# EasyEDA Pro project STEP Controller.eprj, schematic Schematic1, sheet 1 of 3

## Sheets
1 DRIVER: Board Name: Board1; Create Date: 2026-05-18; Page Name: DRIVER; Project Name: STEP Controller; Schematic Name: Schematic1; Update Date: 2026-07-30; Company: EasyEDA.com; Page Size: A4; Version: V1.0
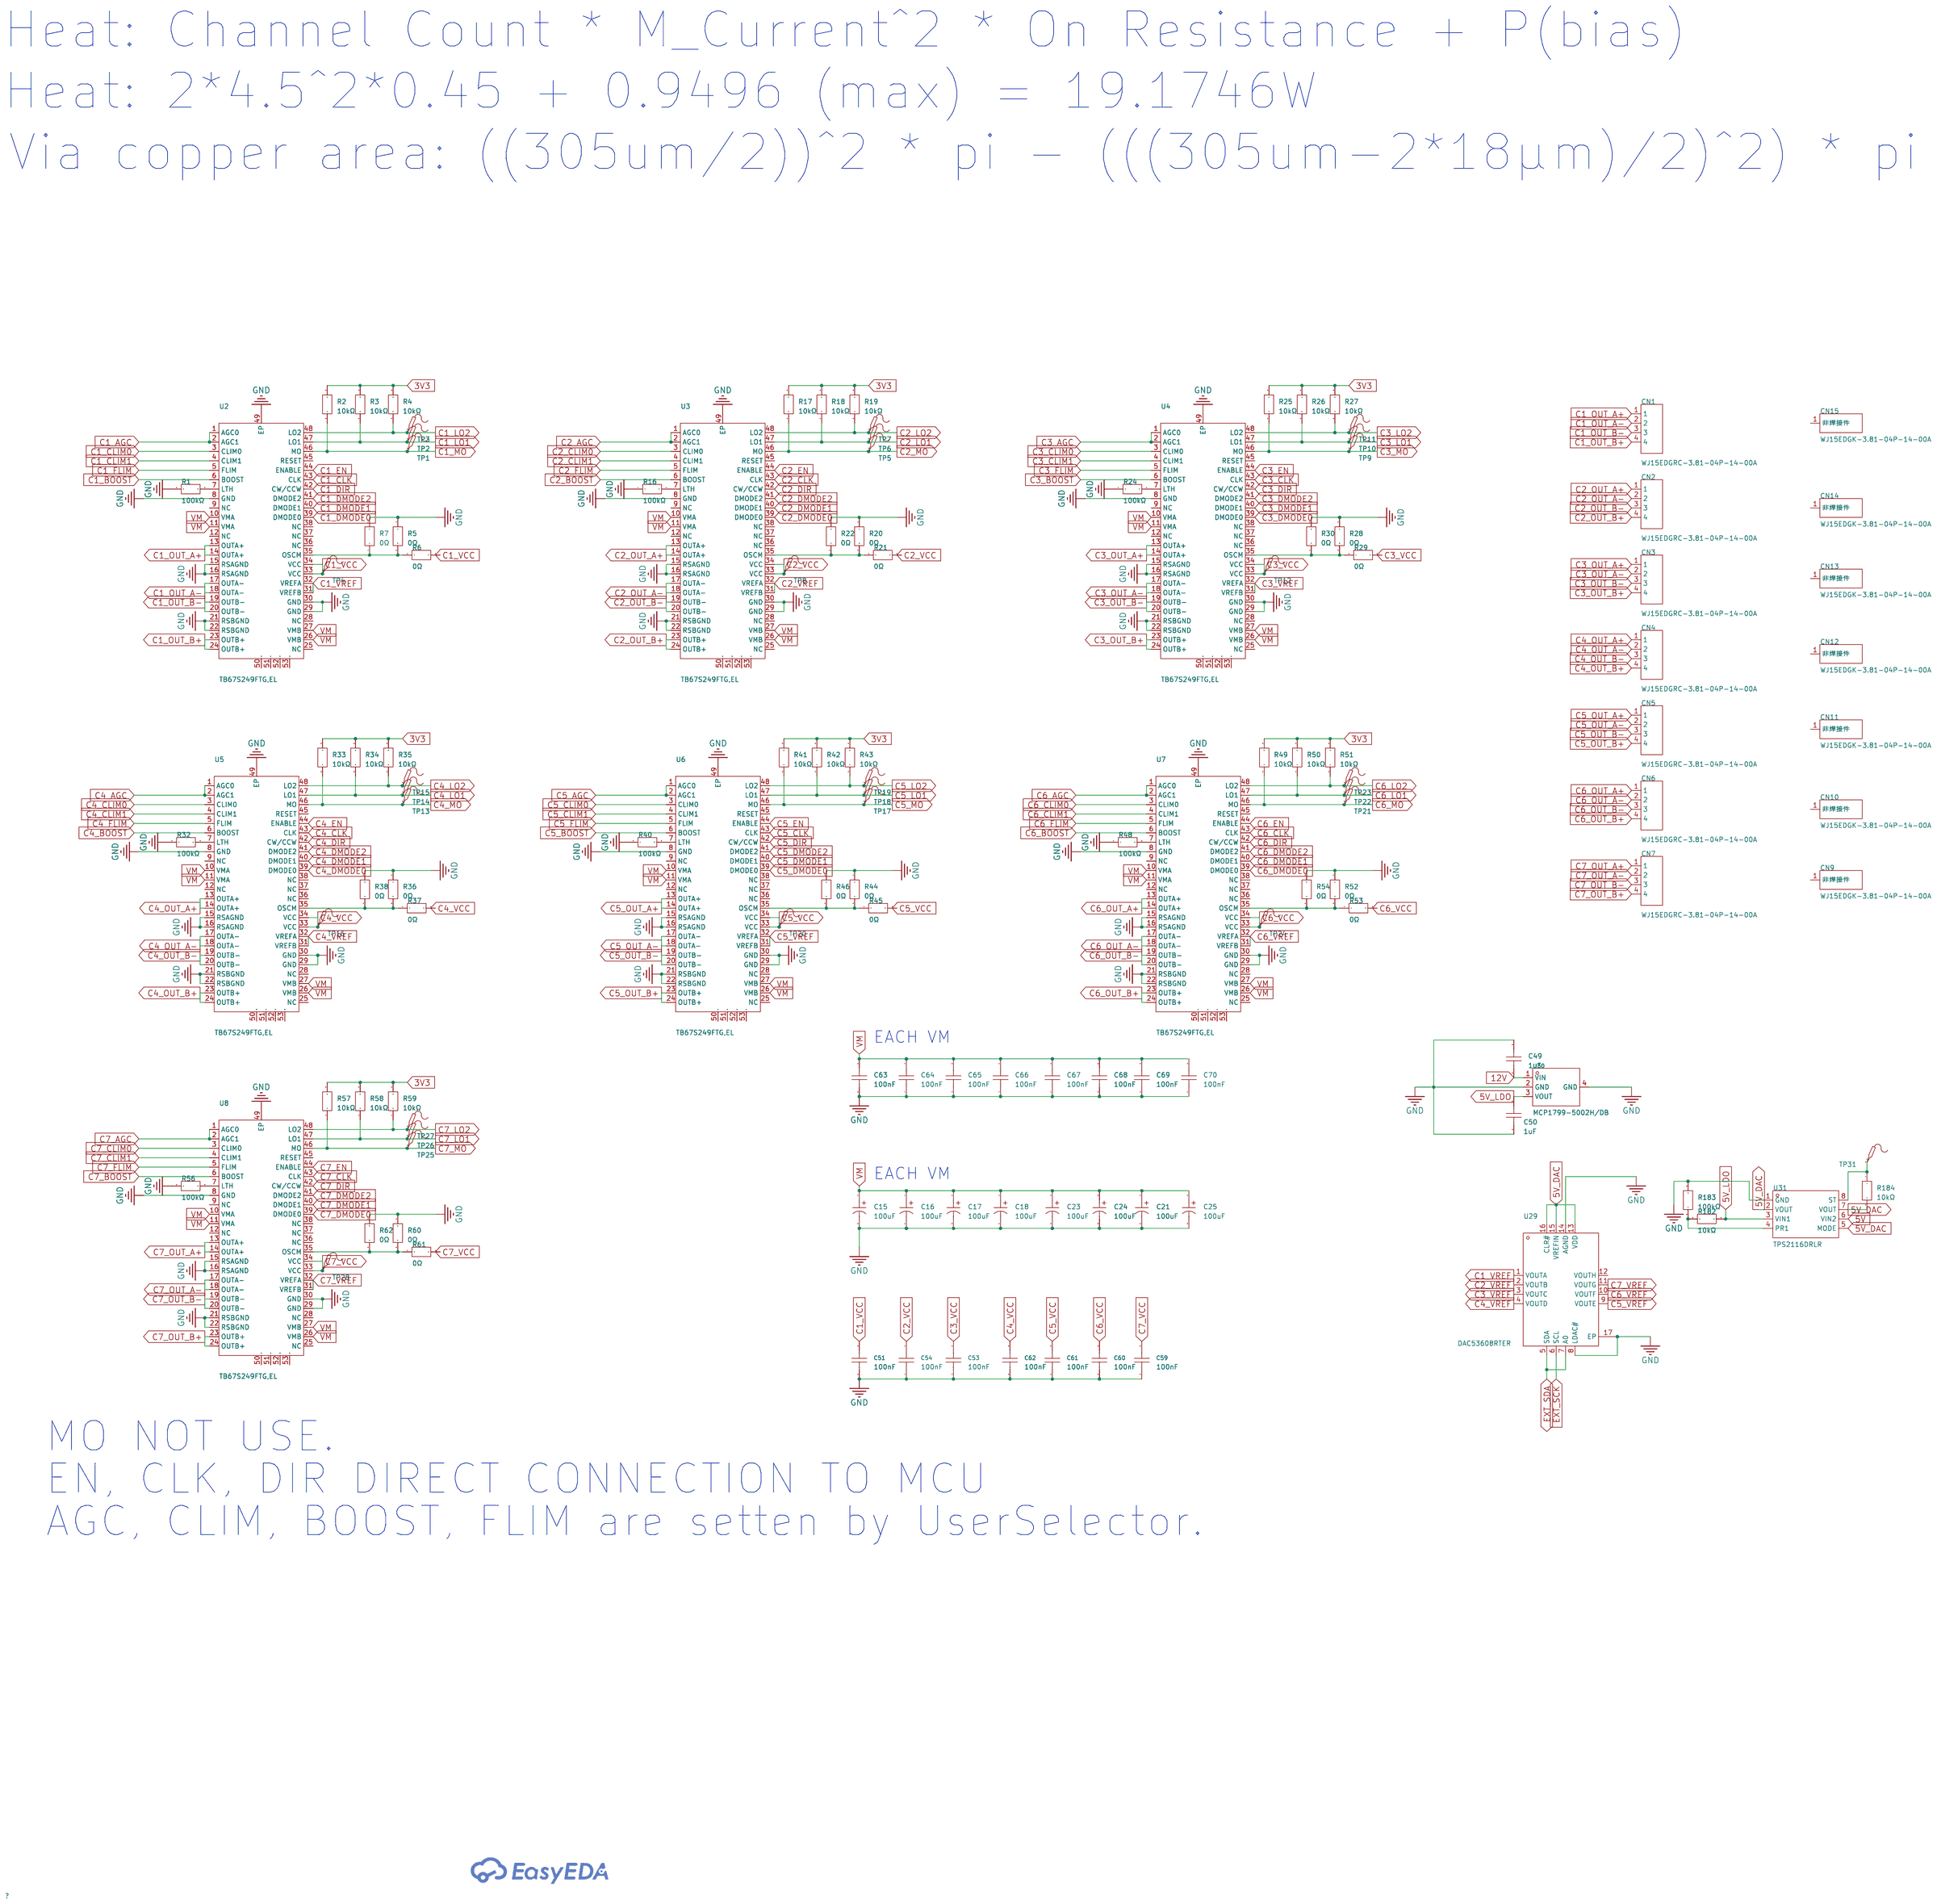
[diagram p0: DRIVER]

## Parts
C15  100uF  [CAP-TH_BD8.0-P3.50-D0.6-FD_1]
C16  100uF  [CAP-TH_BD8.0-P3.50-D0.6-FD_1]
C17  100uF  [CAP-TH_BD8.0-P3.50-D0.6-FD_1]
C18  100uF  [CAP-TH_BD8.0-P3.50-D0.6-FD_1]
C21  100uF  [CAP-TH_BD8.0-P3.50-D0.6-FD_1]
C23  100uF  [CAP-TH_BD8.0-P3.50-D0.6-FD_1]
C24  100uF  [CAP-TH_BD8.0-P3.50-D0.6-FD_1]
C25  100uF  [CAP-TH_BD8.0-P3.50-D0.6-FD_1]
C49  1uF  [C0603]
C50  1uF  [C0603]
C51  100nF  [C0603]
C53  100nF  [C0603]
C54  100nF  [C0603]
C59  100nF  [C0603]
C60  100nF  [C0603]
C61  100nF  [C0603]
C62  100nF  [C0603]
C63  100nF  [C0805]
C64  100nF  [C0805]
C65  100nF  [C0805]
C66  100nF  [C0805]
C67  100nF  [C0805]
C68  100nF  [C0805]
C69  100nF  [C0805]
C70  100nF  [C0805]
CN1  WJ15EDGRC-3.81-04P-14-00A  [CONN-TH_WJ15EDGRC-3.81-4P]
CN2  WJ15EDGRC-3.81-04P-14-00A  [CONN-TH_WJ15EDGRC-3.81-4P]
CN3  WJ15EDGRC-3.81-04P-14-00A  [CONN-TH_WJ15EDGRC-3.81-4P]
CN4  WJ15EDGRC-3.81-04P-14-00A  [CONN-TH_WJ15EDGRC-3.81-4P]
CN5  WJ15EDGRC-3.81-04P-14-00A  [CONN-TH_WJ15EDGRC-3.81-4P]
CN6  WJ15EDGRC-3.81-04P-14-00A  [CONN-TH_WJ15EDGRC-3.81-4P]
CN7  WJ15EDGRC-3.81-04P-14-00A  [CONN-TH_WJ15EDGRC-3.81-4P]
CN9  WJ15EDGK-3.81-04P-14-00A  [FL_001]
CN10  WJ15EDGK-3.81-04P-14-00A  [FL_001]
CN11  WJ15EDGK-3.81-04P-14-00A  [FL_001]
CN12  WJ15EDGK-3.81-04P-14-00A  [FL_001]
CN13  WJ15EDGK-3.81-04P-14-00A  [FL_001]
CN14  WJ15EDGK-3.81-04P-14-00A  [FL_001]
CN15  WJ15EDGK-3.81-04P-14-00A  [FL_001]
R1  100kΩ  [R0603]
R2  10kΩ  [R0603]
R3  10kΩ  [R0603]
R4  10kΩ  [R0603]
R5  0Ω  [R0603]
R6  0Ω  [R0603]
R7  0Ω  [R0603]
R16  100kΩ  [R0603]
R17  10kΩ  [R0603]
R18  10kΩ  [R0603]
R19  10kΩ  [R0603]
R20  0Ω  [R0603]
R21  0Ω  [R0603]
R22  0Ω  [R0603]
R24  100kΩ  [R0603]
R25  10kΩ  [R0603]
R26  10kΩ  [R0603]
R27  10kΩ  [R0603]
R28  0Ω  [R0603]
R29  0Ω  [R0603]
R30  0Ω  [R0603]
R32  100kΩ  [R0603]
R33  10kΩ  [R0603]
R34  10kΩ  [R0603]
R35  10kΩ  [R0603]
R36  0Ω  [R0603]
R37  0Ω  [R0603]
R38  0Ω  [R0603]
R40  100kΩ  [R0603]
R41  10kΩ  [R0603]
R42  10kΩ  [R0603]
R43  10kΩ  [R0603]
R44  0Ω  [R0603]
R45  0Ω  [R0603]
R46  0Ω  [R0603]
R48  100kΩ  [R0603]
R49  10kΩ  [R0603]
R50  10kΩ  [R0603]
R51  10kΩ  [R0603]
R52  0Ω  [R0603]
R53  0Ω  [R0603]
R54  0Ω  [R0603]
R56  100kΩ  [R0603]
R57  10kΩ  [R0603]
R58  10kΩ  [R0603]
R59  10kΩ  [R0603]
R60  0Ω  [R0603]
R61  0Ω  [R0603]
R62  0Ω  [R0603]
R182  10kΩ  [R0603]
R183  100kΩ  [R0603]
R184  10kΩ  [R0603]
TP1  -  [Test-Point-0.5mm]
TP2  -  [Test-Point-0.5mm]
TP3  -  [Test-Point-0.5mm]
TP4  -  [Test-Point-0.5mm]
TP5  -  [Test-Point-0.5mm]
TP6  -  [Test-Point-0.5mm]
TP7  -  [Test-Point-0.5mm]
TP8  -  [Test-Point-0.5mm]
TP9  -  [Test-Point-0.5mm]
TP10  -  [Test-Point-0.5mm]
TP11  -  [Test-Point-0.5mm]
TP12  -  [Test-Point-0.5mm]
TP13  -  [Test-Point-0.5mm]
TP14  -  [Test-Point-0.5mm]
TP15  -  [Test-Point-0.5mm]
TP16  -  [Test-Point-0.5mm]
TP17  -  [Test-Point-0.5mm]
TP18  -  [Test-Point-0.5mm]
TP19  -  [Test-Point-0.5mm]
TP20  -  [Test-Point-0.5mm]
TP21  -  [Test-Point-0.5mm]
TP22  -  [Test-Point-0.5mm]
TP23  -  [Test-Point-0.5mm]
TP24  -  [Test-Point-0.5mm]
TP25  -  [Test-Point-0.5mm]
TP26  -  [Test-Point-0.5mm]
TP27  -  [Test-Point-0.5mm]
TP28  -  [Test-Point-0.5mm]
TP31  -  [Test-Point-0.5mm]
U2  TB67S249FTG,EL  [P-VQFN-48_L7.0-W7.0-P0.50-BL-EP5.5]
U3  TB67S249FTG,EL  [P-VQFN-48_L7.0-W7.0-P0.50-BL-EP5.5]
U4  TB67S249FTG,EL  [P-VQFN-48_L7.0-W7.0-P0.50-BL-EP5.5]
U5  TB67S249FTG,EL  [P-VQFN-48_L7.0-W7.0-P0.50-BL-EP5.5]
U6  TB67S249FTG,EL  [P-VQFN-48_L7.0-W7.0-P0.50-BL-EP5.5]
U7  TB67S249FTG,EL  [P-VQFN-48_L7.0-W7.0-P0.50-BL-EP5.5]
U8  TB67S249FTG,EL  [P-VQFN-48_L7.0-W7.0-P0.50-BL-EP5.5]
U29  DAC53608RTER  [WQFN-16_L3.0-W3.0-P0.50-BL-EP1.7]
U30  MCP1799-5002H/DB  [SOT-223-3_L6.7-W3.7-P2.30-LS7.0-BR]
U31  TPS2116DRLR  [SOT-583-8_L2.1-W1.6-P0.50-LS1.6-BL]

## Library data of the parts
C15-C18 C21 C23-C25 = ERS1JM101F12OTG: Capacitance:100uF Tolerance:±20% Tolerance:±20% Voltage Rating:63V Pin Spacing:3.5mm Diameter:8mm Height - Seated (Max):12mm Operating Temperature:-40℃~+105℃ Operating Temperature:-40℃~+105℃; LCSC Part Name: 100uF ±20% 63V; Supplier Part: C2990945; Manufacturer: AISHI(艾华集团); Supplier Footprint: 插件,D8xL12mm; JLCPCB Part Class: Extended Part; Datasheet: https://item.szlcsc.com/datasheet/ERS1JM101F12OTG/3452241.html; Supplier: LCSC; Tolerance: ±20%; Voltage Rating: 63V; Pin Spacing: 3.5mm; Diameter: 8mm; Height - Seated (Max): 12mm; Operating Temperature: -40℃~+105℃
C49 C50 = CL10A105KB8NNNC: LCSC Part Name: 1uF ±10% 50V; Supplier Part: C15849; Manufacturer: SAMSUNG(三星); Supplier Footprint: 0603; JLCPCB Part Class: Basic Part; Datasheet: https://item.szlcsc.com/datasheet/CL10A105KB8NNNC/16531.html; Supplier: LCSC; Tolerance: ±10%; Voltage Rating: 50V; Temperature Coefficient: X5R
C51 C53 C54 C59-C62 = CC0603KRX7R9BB104: Capacitance:100nF Tolerance:±10% Tolerance:±10% Voltage Rating:50V Temperature Coefficient:X7R; LCSC Part Name: 100nF ±10% 50V; Supplier Part: C14663; Manufacturer: YAGEO(国巨); Supplier Footprint: 0603; JLCPCB Part Class: Basic Part; Datasheet: https://item.szlcsc.com/datasheet/CC0603KRX7R9BB104/15331.html; Supplier: LCSC; Tolerance: ±10%; Voltage Rating: 50V; Temperature Coefficient: X7R
C63-C70 = C0805C104KMRECAUTO: LCSC Part Name: 100nF ±10% 63V; Supplier Part: C2216234; Manufacturer: KEMET(基美); Supplier Footprint: 0805; JLCPCB Part Class: Extended Part; Datasheet: https://item.szlcsc.com/datasheet/C0805C104KMRECAUTO/2308308.html; Supplier: LCSC; Tolerance: ±10%; Voltage Rating: 63V; Temperature Coefficient: X7R
CN1-CN7 = WJ15EDGRC-3.81-04P-14-00A: LCSC Part Name: 卡扣固定 1x4P 3.81mm 排数:1 每排P数:4; Supplier Part: C7245; Manufacturer: KANGNEX(康奈克斯电气); Supplier Footprint: 弯插,P=3.81mm; JLCPCB Part Class: Extended Part; Datasheet: https://item.szlcsc.com/datasheet/WJ15EDGRC-3.81-04P-14-00A/7720.html; Supplier: LCSC; Connector Type: Board Side/Socket - Closed; Termination Style: Hinged (Snap On); Number of Positions or Pins: 1x4P; Pitch: 3.81mm; Color: Green; Mounting Type: Right-Angle; Number of Pins: 4P; Number of Rows: 1; Number of PINs Per Row: 4; Current Rating: 8A; Voltage Rating (Max): 300V; Operating Temperature: -40℃~+105℃
CN9-CN15 = WJ15EDGK-3.81-04P-14-00A: LCSC Part Name: 1x4P 3.81mm 排数:1 每排P数:4; Supplier Part: C7244; Manufacturer: KANGNEX(康奈克斯电气); Supplier Footprint: P=3.81mm; JLCPCB Part Class: Extended Part; Datasheet: https://item.szlcsc.com/datasheet/WJ15EDGK-3.81-04P-14-00A/7719.html; Supplier: LCSC; Connector Type: Male Plug; Number of Positions or Pins: 1x4P; Pitch: 3.81mm; Number of Pins: 4P; Number of Rows: 1; Number of PINs Per Row: 4; Current Rating: 8A; Voltage Rating (Max): 300V; Wire Gauge - AWG: 16~28; Wire Gauge - mm2: 1.5; Operating Temperature: -40℃~+105℃; Connection Type: Screw Connection (M2); Outlet Direction (Vertical Basis): Top Entry
R1 R16 R24 R32 R40 R48 R56 R183 = 0603WAF1003T5E: Type:Thick Film Resistor Resistance:100kΩ Tolerance:±1% Tolerance:±1% Power(Watts):100mW Voltage-Supply(Max):75V Temperature Coefficient:±100ppm/℃ Temperature Coefficient:±100ppm/℃ Operating Temperature:-55℃~+155℃ Operating Temperature:-55℃~+155℃; LCSC Part Name: 100kΩ ±1% 100mW 厚膜电阻; Supplier Part: C25803; Manufacturer: UNI-ROYAL(厚声); Supplier Footprint: 0603; JLCPCB Part Class: Basic Part; Datasheet: https://item.szlcsc.com/datasheet/0603WAF1003T5E/26546.html; Supplier: LCSC; Type: Thick Film Resistor; Tolerance: ±1%; Power(Watts): 100mW; Voltage-Supply(Max): 75V; Temperature Coefficient: ±100ppm/℃; Operating Temperature: -55℃~+155℃
R2-R4 R17-R19 R25-R27 R33-R35 R41-R43 R49-R51 R57-R59 R182 R184 = 0603WAF1002T5E: Type:Thick Film Resistor Resistance:10kΩ Tolerance:±1% Tolerance:±1% Power(Watts):100mW Voltage-Supply(Max):75V Temperature Coefficient:±100ppm/℃ Temperature Coefficient:±100ppm/℃ Operating Temperature:-55℃~+155℃ Operating Temperature:-55℃~+155℃; LCSC Part Name: 厚膜电阻 10kΩ ±1% 100mW; Supplier Part: C25804; Manufacturer: UNI-ROYAL(厚声); Supplier Footprint: 0603; JLCPCB Part Class: Basic Part; Datasheet: https://item.szlcsc.com/datasheet/0603WAF1002T5E/26547.html; Supplier: LCSC; Type: Thick Film Resistor; Tolerance: ±1%; Power(Watts): 100mW; Voltage-Supply(Max): 75V; Temperature Coefficient: ±100ppm/℃; Operating Temperature: -55℃~+155℃
R5-R7 R20-R22 R28-R30 R36-R38 R44-R46 R52-R54 R60-R62 = 0603WAF0000T5E: Type:Thick Film Resistor Resistance:0Ω Tolerance:±1% Tolerance:±1% Power(Watts):100mW Voltage-Supply(Max):75V Temperature Coefficient:- Temperature Coefficient:- Operating Temperature:-55℃~+155℃ Operating Temperature:-55℃~+155℃; LCSC Part Name: 0Ω ±1% 100mW 厚膜电阻; Supplier Part: C21189; Manufacturer: UNI-ROYAL(厚声); Supplier Footprint: 0603; JLCPCB Part Class: Basic Part; Datasheet: https://item.szlcsc.com/datasheet/0603WAF0000T5E/21903.html; Supplier: LCSC; Type: Thick Film Resistor; Tolerance: ±1%; Power(Watts): 100mW; Voltage-Supply(Max): 75V; Operating Temperature: -55℃~+155℃
TP1-TP28 TP31 = Test-Point
U2-U8 = TB67S249FTG,EL: LCSC Part Name: 4.5A 5.25V电机驱动芯片; Supplier Part: C2150608; Manufacturer: TOSHIBA(东芝); Supplier Footprint: QFN-48-EP(7x7); JLCPCB Part Class: Extended Part; Datasheet: https://item.szlcsc.com/datasheet/TB67S249FTG%252CEL/2242655.html; Supplier: LCSC; Control Voltage: 4.75V~5.25V; Motor Drive Voltage(Vm): 10V~47V; Output Current: 4.5A; Number of H-bridges: 2; Drive Type: Bipolar Driver; Step Resolution: 8；2；1；16；4；32; Interface: STEP/DIR; Technology: Yes; RDS(on): 330mΩ; Operating Temperature: -20℃~+85℃
U29 = DAC53608RTER: LCSC Part Name: 采用微型3×3 WQFN封装的八路10位或8位I²C接口缓冲电压输出DAC; Supplier Part: C2679625; Manufacturer: TI(德州仪器); Supplier Footprint: WQFN-16-EP(3x3); JLCPCB Part Class: Extended Part; Datasheet: https://www.ti.com/cn/lit/gpn/dac53608; Supplier: LCSC; Resolution(Bits): 10; Number of Channels: 8; Interface: I2C; Voltage - Supply: 1.8V~5.5V; Settling Time: 10us; Output Type: Voltage Buffer; Integral non - linearity: 1LSB; Operating Temperature: -40℃~+125℃; Power-On Reset: Built-in; Voltage Reference: External; Data rate: 1MHz；100kHz；400kHz; Quiescent Current (Iq): 3mA
U30 = MCP1799-5002H/DB: LCSC Part Name: 输入45V 输出5V 80mA; Supplier Part: C3746279; Manufacturer: MICROCHIP(美国微芯); Supplier Footprint: SOT-223-3; JLCPCB Part Class: Extended Part; Datasheet: https://item.szlcsc.com/datasheet/MCP1799-5002H%252FDB/4313806.html; Supplier: LCSC; Output Type: Fixed; Voltage - Supply: 45V; Output Voltage: 5V; Output Current: 80mA; Power Supply Rejection Ratio (PSRR): 70dB@(1kHz); Voltage Dropout: 300mV@(80mA); standby current: 25uA; Noise: 500uVrms; Features: Short Circuit Protection；Thermal Shutdown; Operating Temperature: -40℃~+150℃@(Ta); Output Configuration: Positive; Number of Outputs: 1
U31 = TPS2116DRLR: LCSC Part Name: 具有手动和优先级切换功能的1.6V至5.5V、2.5A低IQ电源多路复用器; Supplier Part: C3235557; Manufacturer: TI(德州仪器); Supplier Footprint: SOT-583; JLCPCB Part Class: Extended Part; Datasheet: https://www.ti.com/cn/lit/gpn/tps2116; Supplier: LCSC; Features: Operation status indication

## Nets
3V3: R2.2 R3.2 R4.2 R17.2 R18.2 R19.2 R25.2 R26.2 R27.2 R33.2 R34.2 R35.2 R41.2 R42.2 R43.2 R49.2 R50.2 R51.2 R57.2 R58.2 R59.2 ; also on sheet 2
5V: U31.6(VIN2) ; also on sheet 2
5V_DAC: R184.2 U29.13(VDD) U29.15(VREFIN) U29.16(CLR#) U31.2(VOUT) U31.5(MODE) U31.7(VOUT)
5V_LDO: C50.2 R182.1 U30.3(VOUT) U31.3(VIN1)
12V: C49.1 U30.1(VIN) ; also on sheet 2
GND: C15.2 C16.2 C17.2 C18.2 C21.2 C23.2 C24.2 C25.2 C49.2 C50.1 C51.1 C53.1 C54.1 C59.1 C60.1 C61.1 C62.1 C63.1 C64.1 C65.1 C66.1 C67.1 C68.1 C69.1 C70.1 R1.1 R5.1 R7.2 R16.1 R20.1 R22.2 R24.1 R28.1 R30.2 R32.1 R36.1 R38.2 R40.1 R44.1 R46.2 R48.1 R52.1 R54.2 R56.1 R60.1 R62.2 R183.2 U2.8(GND) U2.15(RSAGND) U2.16(RSAGND) U2.21(RSBGND) U2.22(RSBGND) U2.29(GND) U2.30(GND) U2.49(EP) U3.8(GND) U3.15(RSAGND) U3.16(RSAGND) U3.21(RSBGND) U3.22(RSBGND) U3.29(GND) U3.30(GND) U3.49(EP) U4.8(GND) U4.15(RSAGND) U4.16(RSAGND) U4.21(RSBGND) U4.22(RSBGND) U4.29(GND) U4.30(GND) U4.49(EP) U5.8(GND) U5.15(RSAGND) U5.16(RSAGND) U5.21(RSBGND) U5.22(RSBGND) U5.29(GND) U5.30(GND) U5.49(EP) U6.8(GND) U6.15(RSAGND) U6.16(RSAGND) U6.21(RSBGND) U6.22(RSBGND) U6.29(GND) U6.30(GND) U6.49(EP) U7.8(GND) U7.15(RSAGND) U7.16(RSAGND) U7.21(RSBGND) U7.22(RSBGND) U7.29(GND) U7.30(GND) U7.49(EP) U8.8(GND) U8.15(RSAGND) U8.16(RSAGND) U8.21(RSBGND) U8.22(RSBGND) U8.29(GND) U8.30(GND) U8.49(EP) U29.8(LDAC#) U29.14(AGND) U29.17(EP) U30.2(GND) U30.4(GND) U31.1(GND) ; also on sheet 2 3
C1_AGC: U2.1(AGC0) U2.2(AGC1) ; also on sheet 3
C1_BOOST: U2.6(BOOST) ; also on sheet 3
C1_CLIM0: U2.3(CLIM0) ; also on sheet 3
C1_CLIM1: U2.4(CLIM1) ; also on sheet 3
C1_CLK: U2.43(CLK) ; also on sheet 2
C1_DIR: U2.42(CW/CCW) ; also on sheet 2
C1_DMODE0: U2.39(DMODE0) ; also on sheet 2
C1_DMODE1: U2.40(DMODE1) ; also on sheet 2
C1_DMODE2: U2.41(DMODE2) ; also on sheet 2
C1_EN: U2.44(ENABLE) ; also on sheet 2
C1_FLIM: U2.5(FLIM) ; also on sheet 3
C1_LO1: R3.1 TP2.1 U2.47(LO1) ; also on sheet 2
C1_LO2: R4.1 TP3.1 U2.48(LO2) ; also on sheet 2
C1_MO: R2.1 TP1.1 U2.46(MO)
C1_OUT_A+: CN1.1 U2.13(OUTA+) U2.14(OUTA+)
C1_OUT_A-: CN1.2 U2.17(OUTA-) U2.18(OUTA-)
C1_OUT_B+: CN1.4 U2.23(OUTB+) U2.24(OUTB+)
C1_OUT_B-: CN1.3 U2.19(OUTB-) U2.20(OUTB-)
C1_VCC: C51.2 R6.2 TP4.1 U2.33(VCC) U2.34(VCC) ; also on sheet 3
C1_VREF: U2.31(VREFB) U2.32(VREFA) U29.1(VOUTA)
C2_AGC: U3.1(AGC0) U3.2(AGC1) ; also on sheet 3
C2_BOOST: U3.6(BOOST) ; also on sheet 3
C2_CLIM0: U3.3(CLIM0) ; also on sheet 3
C2_CLIM1: U3.4(CLIM1) ; also on sheet 3
C2_CLK: U3.43(CLK) ; also on sheet 2
C2_DIR: U3.42(CW/CCW) ; also on sheet 2
C2_DMODE0: U3.39(DMODE0) ; also on sheet 2
C2_DMODE1: U3.40(DMODE1) ; also on sheet 2
C2_DMODE2: U3.41(DMODE2) ; also on sheet 2
C2_EN: U3.44(ENABLE) ; also on sheet 2
C2_FLIM: U3.5(FLIM) ; also on sheet 3
C2_LO1: R18.1 TP6.1 U3.47(LO1) ; also on sheet 2
C2_LO2: R19.1 TP7.1 U3.48(LO2) ; also on sheet 2
C2_MO: R17.1 TP5.1 U3.46(MO)
C2_OUT_A+: CN2.1 U3.13(OUTA+) U3.14(OUTA+)
C2_OUT_A-: CN2.2 U3.17(OUTA-) U3.18(OUTA-)
C2_OUT_B+: CN2.4 U3.23(OUTB+) U3.24(OUTB+)
C2_OUT_B-: CN2.3 U3.19(OUTB-) U3.20(OUTB-)
C2_VCC: C54.2 R21.2 TP8.1 U3.33(VCC) U3.34(VCC) ; also on sheet 3
C2_VREF: U3.31(VREFB) U3.32(VREFA) U29.2(VOUTB)
C3_AGC: U4.1(AGC0) U4.2(AGC1) ; also on sheet 3
C3_BOOST: U4.6(BOOST) ; also on sheet 3
C3_CLIM0: U4.3(CLIM0) ; also on sheet 3
C3_CLIM1: U4.4(CLIM1) ; also on sheet 3
C3_CLK: U4.43(CLK) ; also on sheet 2
C3_DIR: U4.42(CW/CCW) ; also on sheet 2
C3_DMODE0: U4.39(DMODE0) ; also on sheet 2
C3_DMODE1: U4.40(DMODE1) ; also on sheet 2
C3_DMODE2: U4.41(DMODE2) ; also on sheet 2
C3_EN: U4.44(ENABLE) ; also on sheet 2
C3_FLIM: U4.5(FLIM) ; also on sheet 3
C3_LO1: R26.1 TP10.1 U4.47(LO1) ; also on sheet 2
C3_LO2: R27.1 TP11.1 U4.48(LO2) ; also on sheet 2
C3_MO: R25.1 TP9.1 U4.46(MO)
C3_OUT_A+: CN3.1 U4.13(OUTA+) U4.14(OUTA+)
C3_OUT_A-: CN3.2 U4.17(OUTA-) U4.18(OUTA-)
C3_OUT_B+: CN3.4 U4.23(OUTB+) U4.24(OUTB+)
C3_OUT_B-: CN3.3 U4.19(OUTB-) U4.20(OUTB-)
C3_VCC: C53.2 R29.2 TP12.1 U4.33(VCC) U4.34(VCC) ; also on sheet 3
C3_VREF: U4.31(VREFB) U4.32(VREFA) U29.3(VOUTC)
C4_AGC: U5.1(AGC0) U5.2(AGC1) ; also on sheet 3
C4_BOOST: U5.6(BOOST) ; also on sheet 3
C4_CLIM0: U5.3(CLIM0) ; also on sheet 3
C4_CLIM1: U5.4(CLIM1) ; also on sheet 3
C4_CLK: U5.43(CLK) ; also on sheet 2
C4_DIR: U5.42(CW/CCW) ; also on sheet 2
C4_DMODE0: U5.39(DMODE0) ; also on sheet 2
C4_DMODE1: U5.40(DMODE1) ; also on sheet 2
C4_DMODE2: U5.41(DMODE2) ; also on sheet 2
C4_EN: U5.44(ENABLE) ; also on sheet 2
C4_FLIM: U5.5(FLIM) ; also on sheet 3
C4_LO1: R34.1 TP14.1 U5.47(LO1) ; also on sheet 2
C4_LO2: R35.1 TP15.1 U5.48(LO2) ; also on sheet 2
C4_MO: R33.1 TP13.1 U5.46(MO)
C4_OUT_A+: CN4.1 U5.13(OUTA+) U5.14(OUTA+)
C4_OUT_A-: CN4.2 U5.17(OUTA-) U5.18(OUTA-)
C4_OUT_B+: CN4.4 U5.23(OUTB+) U5.24(OUTB+)
C4_OUT_B-: CN4.3 U5.19(OUTB-) U5.20(OUTB-)
C4_VCC: C62.2 R37.2 TP16.1 U5.33(VCC) U5.34(VCC) ; also on sheet 3
C4_VREF: U5.31(VREFB) U5.32(VREFA) U29.4(VOUTD)
C5_AGC: U6.1(AGC0) U6.2(AGC1) ; also on sheet 3
C5_BOOST: U6.6(BOOST) ; also on sheet 3
C5_CLIM0: U6.3(CLIM0) ; also on sheet 3
C5_CLIM1: U6.4(CLIM1) ; also on sheet 3
C5_CLK: U6.43(CLK) ; also on sheet 2
C5_DIR: U6.42(CW/CCW) ; also on sheet 2
C5_DMODE0: U6.39(DMODE0) ; also on sheet 2
C5_DMODE1: U6.40(DMODE1) ; also on sheet 2
C5_DMODE2: U6.41(DMODE2) ; also on sheet 2
C5_EN: U6.44(ENABLE) ; also on sheet 2
C5_FLIM: U6.5(FLIM) ; also on sheet 3
C5_LO1: R42.1 TP18.1 U6.47(LO1) ; also on sheet 2
C5_LO2: R43.1 TP19.1 U6.48(LO2) ; also on sheet 2
C5_MO: R41.1 TP17.1 U6.46(MO)
C5_OUT_A+: CN5.1 U6.13(OUTA+) U6.14(OUTA+)
C5_OUT_A-: CN5.2 U6.17(OUTA-) U6.18(OUTA-)
C5_OUT_B+: CN5.4 U6.23(OUTB+) U6.24(OUTB+)
C5_OUT_B-: CN5.3 U6.19(OUTB-) U6.20(OUTB-)
C5_VCC: C61.2 R45.2 TP20.1 U6.33(VCC) U6.34(VCC) ; also on sheet 3
C5_VREF: U6.31(VREFB) U6.32(VREFA) U29.9(VOUTE)
C6_AGC: U7.1(AGC0) U7.2(AGC1) ; also on sheet 3
C6_BOOST: U7.6(BOOST) ; also on sheet 3
C6_CLIM0: U7.3(CLIM0) ; also on sheet 3
C6_CLIM1: U7.4(CLIM1) ; also on sheet 3
C6_CLK: U7.43(CLK) ; also on sheet 2
C6_DIR: U7.42(CW/CCW) ; also on sheet 2
C6_DMODE0: U7.39(DMODE0) ; also on sheet 2
C6_DMODE1: U7.40(DMODE1) ; also on sheet 2
C6_DMODE2: U7.41(DMODE2) ; also on sheet 2
C6_EN: U7.44(ENABLE) ; also on sheet 2
C6_FLIM: U7.5(FLIM) ; also on sheet 3
C6_LO1: R50.1 TP22.1 U7.47(LO1) ; also on sheet 2
C6_LO2: R51.1 TP23.1 U7.48(LO2) ; also on sheet 2
C6_MO: R49.1 TP21.1 U7.46(MO)
C6_OUT_A+: CN6.1 U7.13(OUTA+) U7.14(OUTA+)
C6_OUT_A-: CN6.2 U7.17(OUTA-) U7.18(OUTA-)
C6_OUT_B+: CN6.4 U7.23(OUTB+) U7.24(OUTB+)
C6_OUT_B-: CN6.3 U7.19(OUTB-) U7.20(OUTB-)
C6_VCC: C60.2 R53.2 TP24.1 U7.33(VCC) U7.34(VCC) ; also on sheet 3
C6_VREF: U7.31(VREFB) U7.32(VREFA) U29.10(VOUTF)
C7_AGC: U8.1(AGC0) U8.2(AGC1) ; also on sheet 3
C7_BOOST: U8.6(BOOST) ; also on sheet 3
C7_CLIM0: U8.3(CLIM0) ; also on sheet 3
C7_CLIM1: U8.4(CLIM1) ; also on sheet 3
C7_CLK: U8.43(CLK) ; also on sheet 2
C7_DIR: U8.42(CW/CCW) ; also on sheet 2
C7_DMODE0: U8.39(DMODE0) ; also on sheet 2
C7_DMODE1: U8.40(DMODE1) ; also on sheet 2
C7_DMODE2: U8.41(DMODE2) ; also on sheet 2
C7_EN: U8.44(ENABLE) ; also on sheet 2
C7_FLIM: U8.5(FLIM) ; also on sheet 3
C7_LO1: R58.1 TP26.1 U8.47(LO1) ; also on sheet 2
C7_LO2: R59.1 TP27.1 U8.48(LO2) ; also on sheet 2
C7_MO: R57.1 TP25.1 U8.46(MO)
C7_OUT_A+: CN7.1 U8.13(OUTA+) U8.14(OUTA+)
C7_OUT_A-: CN7.2 U8.17(OUTA-) U8.18(OUTA-)
C7_OUT_B+: CN7.4 U8.23(OUTB+) U8.24(OUTB+)
C7_OUT_B-: CN7.3 U8.19(OUTB-) U8.20(OUTB-)
C7_VCC: C59.2 R61.2 TP28.1 U8.33(VCC) U8.34(VCC) ; also on sheet 3
C7_VREF: U8.31(VREFB) U8.32(VREFA) U29.11(VOUTG)
EXT_SCK: U29.6(SCL) ; also on sheet 2
EXT_SDA: U29.5(SDA) U29.7(A0) ; also on sheet 2
VM: C15.1 C16.1 C17.1 C18.1 C21.1 C23.1 C24.1 C25.1 C63.2 C64.2 C65.2 C66.2 C67.2 C68.2 C69.2 C70.2 U2.10(VMA) U2.11(VMA) U2.26(VMB) U2.27(VMB) U3.10(VMA) U3.11(VMA) U3.26(VMB) U3.27(VMB) U4.10(VMA) U4.11(VMA) U4.26(VMB) U4.27(VMB) U5.10(VMA) U5.11(VMA) U5.26(VMB) U5.27(VMB) U6.10(VMA) U6.11(VMA) U6.26(VMB) U6.27(VMB) U7.10(VMA) U7.11(VMA) U7.26(VMB) U7.27(VMB) U8.10(VMA) U8.11(VMA) U8.26(VMB) U8.27(VMB) ; also on sheet 2
$1N6408: R1.2 U2.7(LTH)
$1N7416: R5.2 R6.1 R7.1 U2.35(OSCM)
$1N9996: R16.2 U3.7(LTH)
$1N10003: R20.2 R21.1 R22.1 U3.35(OSCM)
$1N10930: R24.2 U4.7(LTH)
$1N10937: R28.2 R29.1 R30.1 U4.35(OSCM)
$1N17192: R32.2 U5.7(LTH)
$1N17199: R36.2 R37.1 R38.1 U5.35(OSCM)
$1N17227: R40.2 U6.7(LTH)
$1N17234: R44.2 R45.1 R46.1 U6.35(OSCM)
$1N17262: R48.2 U7.7(LTH)
$1N17269: R52.2 R53.1 R54.1 U7.35(OSCM)
$1N18256: R56.2 U8.7(LTH)
$1N18263: R60.2 R61.1 R62.1 U8.35(OSCM)
$1N64774: R182.2 R183.1 U31.4(PR1)
$1N64884: R184.1 TP31.1 U31.8(ST)

Not connected (* = marked no-connect by the designer): CN9 1(非焊接件); CN10 1(非焊接件); CN11 1(非焊接件); CN12 1(非焊接件); CN13 1(非焊接件); CN14 1(非焊接件); CN15 1(非焊接件); U2 9(NC) 12(NC) 25(NC) 28(NC) 36(NC) 37(NC) 38(NC) 45(RESET) 50 51 52 53; U3 9(NC) 12(NC) 25(NC) 28(NC) 36(NC) 37(NC) 38(NC) 45(RESET) 50 51 52 53; U4 9(NC) 12(NC) 25(NC) 28(NC) 36(NC) 37(NC) 38(NC) 45(RESET) 50 51 52 53; U5 9(NC) 12(NC) 25(NC) 28(NC) 36(NC) 37(NC) 38(NC) 45(RESET) 50 51 52 53; U6 9(NC) 12(NC) 25(NC) 28(NC) 36(NC) 37(NC) 38(NC) 45(RESET) 50 51 52 53; U7 9(NC) 12(NC) 25(NC) 28(NC) 36(NC) 37(NC) 38(NC) 45(RESET) 50 51 52 53; U8 9(NC) 12(NC) 25(NC) 28(NC) 36(NC) 37(NC) 38(NC) 45(RESET) 50 51 52 53; U29 12(VOUTH)

## Notes on the sheets
sheet 1
- Heat: Channel Count * M_Current^2 * On Resistance + P(bias)
- Heat: 2*4.5^2*0.45 + 0.9496 (max) = 19.1746W
- Via copper area: ((305um/2))^2 * pi - (((305um-2*18μm)/2)^2) * pi
- EACH VM
- EACH VM
- MO NOT USE.
- EN, CLK, DIR DIRECT CONNECTION TO MCU
- AGC, CLIM, BOOST, FLIM are setten by UserSelector.
